# Altium schematic sheet schema_mixer.SchDoc
size A4
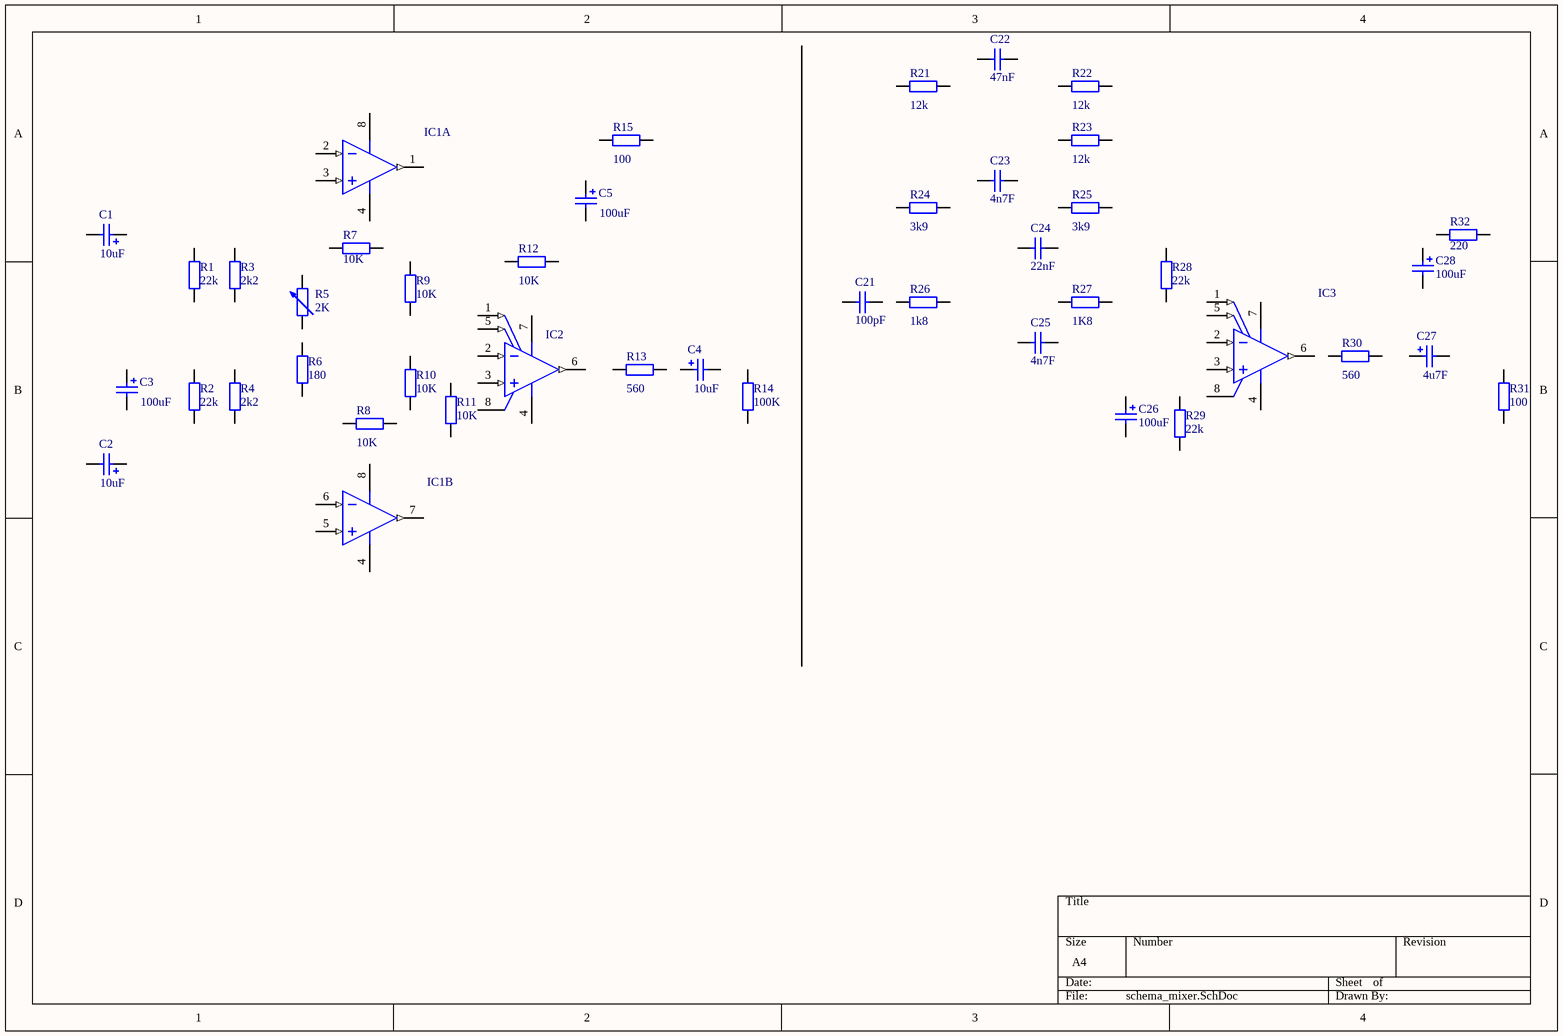
[diagram p0: schema_mixer.SchDoc]

## Parts
C1  value 10uF  [POLAR0.8]  (hidden comment: Cap Pol2)
C2  value 10uF  [POLAR0.8]  (hidden comment: Cap Pol2)
C3  value 100uF  [POLAR0.8]  (hidden comment: Cap Pol2)
C4  value 10uF  [POLAR0.8]  (hidden comment: Cap Pol2)
C5  value 100uF  [POLAR0.8]  (hidden comment: Cap Pol2)
C21  value 100pF  [RAD-0.3]  (hidden comment: Cap)
C22  value 47nF  [RAD-0.3]  (hidden comment: Cap)
C23  value 4n7F  [RAD-0.3]  (hidden comment: Cap)
C24  value 22nF  [RAD-0.3]  (hidden comment: Cap)
C25  value 4n7F  [RAD-0.3]  (hidden comment: Cap)
C26  value 100uF  [POLAR0.8]  (hidden comment: Cap Pol2)
C27  value 4u7F  [POLAR0.8]  (hidden comment: Cap Pol2)
C28  value 100uF  [POLAR0.8]  (hidden comment: Cap Pol2)
IC1  LM833DR2G  [opamp_LM833]  (value not drawn)  (parts A,B of 2)
IC2  TL061CD  [D0008A_N]  (value not drawn)
IC3  TL061CD  [D0008A_N]  (value not drawn)
R1  value 22k  [AXIAL-0.4]  (hidden comment: Res2)
R2  value 22k  [AXIAL-0.4]  (hidden comment: Res2)
R3  value 2k2  [AXIAL-0.4]  (hidden comment: Res2)
R4  value 2k2  [AXIAL-0.4]  (hidden comment: Res2)
R5  value 2K  [AXIAL-0.6]  (hidden comment: Res Adj2)
R6  value 180  [AXIAL-0.4]  (hidden comment: Res2)
R7  value 10K  [AXIAL-0.4]  (hidden comment: Res2)
R8  value 10K  [AXIAL-0.4]  (hidden comment: Res2)
R9  value 10K  [AXIAL-0.4]  (hidden comment: Res2)
R10  value 10K  [AXIAL-0.4]  (hidden comment: Res2)
R11  value 10K  [AXIAL-0.4]  (hidden comment: Res2)
R12  value 10K  [AXIAL-0.4]  (hidden comment: Res2)
R13  value 560  [AXIAL-0.4]  (hidden comment: Res2)
R14  value 100K  [AXIAL-0.4]  (hidden comment: Res2)
R15  value 100  [AXIAL-0.4]  (hidden comment: Res2)
R21  value 12k  [AXIAL-0.4]  (hidden comment: Res2)
R22  value 12k  [AXIAL-0.4]  (hidden comment: Res2)
R23  value 12k  [AXIAL-0.4]  (hidden comment: Res2)
R24  value 3k9  [AXIAL-0.4]  (hidden comment: Res2)
R25  value 3k9  [AXIAL-0.4]  (hidden comment: Res2)
R26  value 1k8  [AXIAL-0.4]  (hidden comment: Res2)
R27  value 1K8  [AXIAL-0.4]  (hidden comment: Res2)
R28  value 22k  [AXIAL-0.4]  (hidden comment: Res2)
R29  value 22k  [AXIAL-0.4]  (hidden comment: Res2)
R30  value 560  [AXIAL-0.4]  (hidden comment: Res2)
R31  value 100  [AXIAL-0.4]  (hidden comment: Res2)
R32  value 220  [AXIAL-0.4]  (hidden comment: Res2)

## Nets

Not connected (* = marked no-connect by the designer): C1 1 2; C2 1 2; C3 1 2; C4 1 2; C5 1 2; C21 1 2; C22 1 2; C23 1 2; C24 1 2; C25 1 2; C26 1 2; C27 1 2; C28 1 2; IC1 1(OUT1) 2(IN1-) 3(IN1+) 4(VEE) 5(IN2+) 6(IN2-) 7(OUT2) 8(VCC); IC2 1(OFFSET_N1) 2(IN-) 3(IN+) 4(VCC-) 5(OFFSET_N2) 6(OUT) 7(VCC+) 8(NC); IC3 1(OFFSET_N1) 2(IN-) 3(IN+) 4(VCC-) 5(OFFSET_N2) 6(OUT) 7(VCC+) 8(NC); R1 1 2; R2 1 2; R3 1 2; R4 1 2; R5 1 2; R6 1 2; R7 1 2; R8 1 2; R9 1 2; R10 1 2; R11 1 2; R12 1 2; R13 1 2; R14 1 2; R15 1 2; R21 1 2; R22 1 2; R23 1 2; R24 1 2; R25 1 2; R26 1 2; R27 1 2; R28 1 2; R29 1 2; R30 1 2; R31 1 2; R32 1 2

## Library data of the parts
C1-C5 C26-C28 = Cap Pol2: Polarized Capacitor (Axial); Published: 8-Jun-2000; LatestRevisionDate: 17-Jul-2002; LatestRevisionNote: Re-released for DXP Platform.; PackageReference: POLAR0.8; Publisher: Altium Limited; PackageDescription: Polarized Capacitor; 2 Leads
C21-C25 = Cap: Capacitor; Published: 8-Jun-2000; LatestRevisionDate: 17-Jul-2002; LatestRevisionNote: Re-released for DXP Platform.; PackageReference: RAD-0.3; Publisher: Altium Limited; PackageDescription: Radial Cap, Thru-Hole; 2 Leads; 0.3 in Pin Spacing
IC1 = opamp_LM833: Low Noise, Audio Dual Operational Amplifier, -40 to 85 degC, 8-Pin SOIC, Pb-Free, Tape and Reel; Manufacturer: On Semiconductor; GBW Typ (MHz): 15; SR Typ (V/uS): 7; PackageReference: SOIC-8-751-07; ComponentLink3URL: http://www.onsemi.com/pub_link/Collateral/751-07.PDF; ComponentLink2URL: http://www.onsemi.cn/pub_link/Collateral/LM833-D.PDF; PackageVersion: Rev. AK, 02/2011; ComponentLink2Description: Datasheet; Mounting Technology: Surface Mount; Packing: Tape and Reel; PackageDescription: 8-Pin Small Outline Integrated Circuit, Body 4.9 x 3.9 mm, Pitch 1.27 mm; RoHS: TRUE; ComponentLink3Description: Package Specification; DatasheetVersion: Rev. 6; ComponentLink1URL: http://www.onsemi.com/; PartNumber: LM833DR2G; ComponentLink1Description: Manufacturer URL
IC2 = opamp_L061: Low-Power JFET-Input General-Purpose Operational Amplifier, 7 to 36 V, 0 to 70 degC, 8-pin SOIC (D8), Green (RoHS & no Sb/Br); Manufacturer: Texas Instruments; Sub Family: General Purpose Amplifier, High Supply Voltage Amplifier (>=30V), Low Power Amp (<=500uA); Iq per channel(Max)(mA): 0.25; CMRR(Min)(dB): 70; IIB(Max)(pA): 400; Slew Rate(Typ)(V/us): 3.5; Number of Channels: 1; Total Supply Voltage(Max)(+5V is 5, +/-5V is 10): 36; Vn at 1kHz(Typ)(nV/rtHz): 42; Vio (25C)(Max)(mV): 15; Rating: Military; Offset Drift(Typ)(uV/C): 10; Total Supply Voltage(Min)(+5V is 5, +/-5V is 10): 7; Eco-Plan: Green (RoHS & no Sb/Br); ComponentLink2Description: Datasheet; PackageReference: D0008A; ComponentLink3Description: Package Specification; ComponentLink2URL: http://www.ti.com/lit/ds/symlink/tl061.pdf; Mounting Technology: Surface Mount; ComponentLink1Description: Manufacturer URL; PackageDescription: 8-Pin Plastic Small Outline, Body 4.9 x 3.9 mm, Pitch 1.27 mm; DatasheetVersion: SLOS078J; PartNumber: TL061CD; Code_JEDEC: MS-012; GBW(Typ)(MHz): 1; ComponentLink3URL: http://www.ti.com/litv/pdf/msoi002j; ComponentLink1URL: http://www.ti.com/; PackageVersion: 4040047-3/M, 06/2011
IC3 = opamp_TL061: Low-Power JFET-Input General-Purpose Operational Amplifier, 7 to 36 V, 0 to 70 degC, 8-pin SOIC (D8), Green (RoHS & no Sb/Br); Manufacturer: Texas Instruments; Sub Family: General Purpose Amplifier, High Supply Voltage Amplifier (>=30V), Low Power Amp (<=500uA); Iq per channel(Max)(mA): 0.25; CMRR(Min)(dB): 70; IIB(Max)(pA): 400; Slew Rate(Typ)(V/us): 3.5; Number of Channels: 1; Total Supply Voltage(Max)(+5V is 5, +/-5V is 10): 36; Vn at 1kHz(Typ)(nV/rtHz): 42; Vio (25C)(Max)(mV): 15; Rating: Military; Offset Drift(Typ)(uV/C): 10; Total Supply Voltage(Min)(+5V is 5, +/-5V is 10): 7; Eco-Plan: Green (RoHS & no Sb/Br); ComponentLink2Description: Datasheet; PackageReference: D0008A; ComponentLink3Description: Package Specification; ComponentLink2URL: http://www.ti.com/lit/ds/symlink/tl061.pdf; Mounting Technology: Surface Mount; ComponentLink1Description: Manufacturer URL; PackageDescription: 8-Pin Plastic Small Outline, Body 4.9 x 3.9 mm, Pitch 1.27 mm; DatasheetVersion: SLOS078J; PartNumber: TL061CD; Code_JEDEC: MS-012; GBW(Typ)(MHz): 1; ComponentLink3URL: http://www.ti.com/litv/pdf/msoi002j; ComponentLink1URL: http://www.ti.com/; PackageVersion: 4040047-3/M, 06/2011
R1-R4 R6-R15 R21-R32 = Res2: Resistor; Published: 8-Jun-2000; LatestRevisionDate: 17-Jul-2002; LatestRevisionNote: Re-released for DXP Platform.; PackageReference: AXIAL-0.4; Publisher: Altium Limited; PackageDescription: Axial Device, Thru-Hole; 2 Leads; 0.4 in Pin Spacing
R5 = Res Adj2: Variable Resistor; Set Position: 0.5; Published: 8-Jun-2000; LatestRevisionDate: 17-Jul-2002; LatestRevisionNote: Re-released for DXP Platform.; PackageReference: AXIAL-0.6; Publisher: Altium Limited; PackageDescription: Axial Device, Thru-Hole; 2 Leads; 0.6 in Pin Spacing